# EAGLE design mtD-Relay1C(ACTP112)fotCo2 (EAGLE 7.4.0)
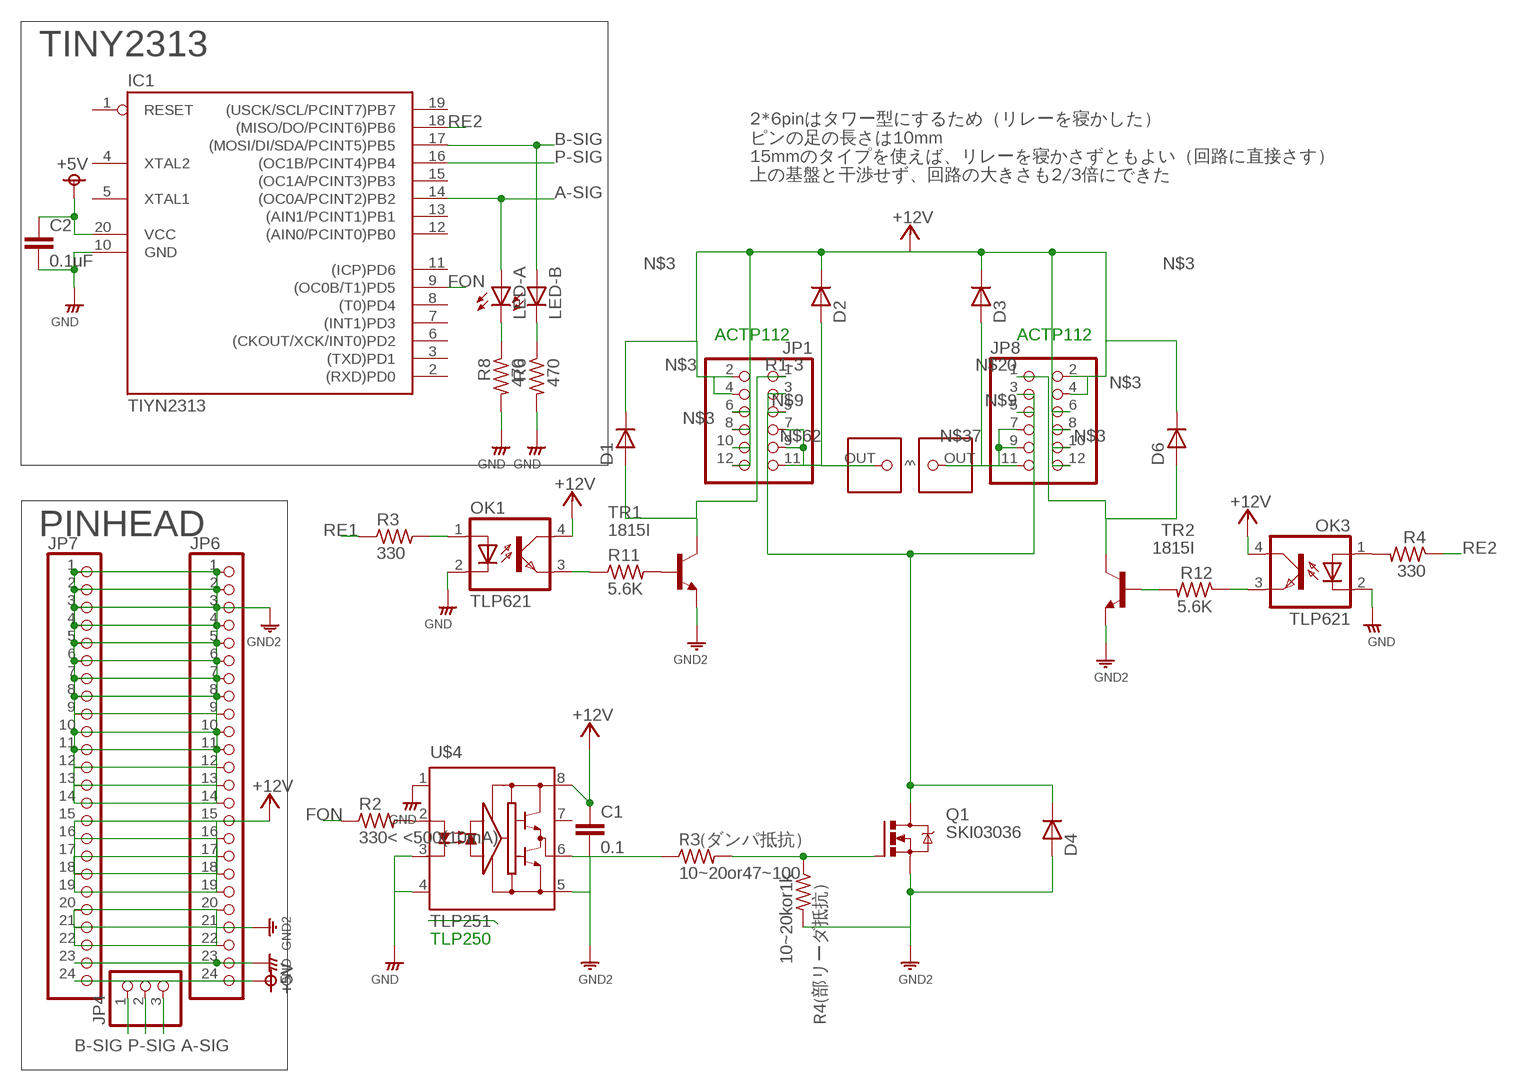
[diagram p0: schematic, sheet 1]

## Parts
C1  0.1  MLCC-2  [MLCC_25]
C2  0.1uF  MLCC-2  [MLCC_25]
D1  DIODE_JISSO2  [DIODE_JISSO2]
D2  DIODE_JISSO2  [DIODE_JISSO2]
D3  DIODE_JISSO2  [DIODE_JISSO2]
D4  DIODE_JISSO2  [DIODE_JISSO2]
D6  DIODE_JISSO2  [DIODE_JISSO2]
IC1  TIYN2313  [DIL20]
JP1  PINHD-2X6  [2X06]
JP4  PINHD-1X3  [1X03]
JP6  PINHD-1X24  [1X24]
JP7  PINHD-1X24  [1X24]
JP8  PINHD-2X6  [2X06]
LED-A  LED3MM  [LED3MM]
LED-B  LED3MM  [LED3MM]
OK1  TLP621  [DIP4]
OK3  TLP621  [DIP4]
Q1  SKI03036  [SKI03036]
R2  330< <500(10mA)  RESISTORS3216  [3216]
R3  330  RESISTORS-3  [R_0.3]
R3(ダンパ抵抗）  10~20or47~100  RESISTORS1608  [1608]
R4  330  RESISTORS-3  [R_0.3]
R4(部リーダ抵抗）  10~20kor1k  RESISTORS1608  [1608]
R6  470  RESISTORS3216  [3216]
R8  470  RESISTORS3216  [3216]
R11  5.6K  RESISTORS-3  [R_0.3]
R12  5.6K  RESISTORS-3  [R_0.3]
TR1  1815I  [TO92A]
TR2  1815I  [TO92A]
U$3  OUTPIN-PV-3  [OUTPIN-PV-3]
U$4  TLP251  [DIP8]
U$15  OUTPIN-PV-3  [OUTPIN-PV-3]

## Nets
+5V: C2.1 IC1.20(VCC) JP6.24 JP7.24
+12V: OK1.4(COL) OK3.4(COL)
A-SIG: IC1.14((OC0A/PCINT2)PB2) JP4.3 LED-A.A
B-SIG: IC1.17((MOSI/DI/SDA/PCINT5)PB5) JP4.1 LED-B.A
FON: IC1.9((OC0B/T1)PD5) R2.P$5
GND: C2.2 IC1.10(GND) JP6.23 JP7.23 OK1.2(C) OK3.2(C) R6.P$6 R8.P$6 U$4.1 U$4.3 U$4.4
N$2: R11.2 TR1.B
N$3: C1.1 D1.P$2(C) D2.P$2(C) D3.P$2(C) D6.P$2(C) JP1.2 JP1.4 JP1.6 JP1.8 JP1.10 JP1.12 JP6.15 JP6.16 JP6.17 JP6.18 JP6.19 JP7.15 JP7.16 JP7.17 JP7.18 JP7.19 JP8.2 JP8.4 JP8.6 JP8.8 JP8.10 JP8.12 U$4.8 ; supply symbol labelled +12V
N$5: R12.2 TR2.B
N$6: R3(ダンパ抵抗）.P$1 U$4.6
N$8: Q1.G R3(ダンパ抵抗）.P$2 R4(部リーダ抵抗）.P$1
N$9: D4.P$2(C) JP1.3 JP1.5 JP8.3 JP8.5 Q1.D
N$10: R2.P$6 U$4.2
N$11: LED-B.K(C) R6.P$5
N$12: LED-A.K(C) R8.P$5
N$17: OK1.1(A) R3.2
N$20: D6.P$1(A) JP8.1 TR2.C
N$21: OK1.3(EMIT) R11.1
N$37: D3.P$1(A) JP8.7 JP8.9 JP8.11 U$15.OUT(^)
N$38: OK3.1(A) R4.2
N$43: C1.2 D4.P$1(A) JP6.1 JP6.2 JP6.3 JP6.4 JP6.5 JP6.6 JP6.7 JP6.8 JP6.9 JP6.10 JP6.11 JP6.12 JP6.13 JP6.14 JP6.20 JP6.21 JP6.22 JP7.1 JP7.2 JP7.3 JP7.4 JP7.5 JP7.6 JP7.7 JP7.8 JP7.9 JP7.10 JP7.11 JP7.12 JP7.13 JP7.14 JP7.20 JP7.21 JP7.22 Q1.S R4(部リーダ抵抗）.P$2 TR1.E TR2.E U$4.5 ; supply symbol labelled GND2
N$44: OK3.3(EMIT) R12.1
N$62: D2.P$1(A) JP1.7 JP1.9 JP1.11 U$3.OUT(^)
P-SIG: IC1.16((OC1B/PCINT4)PB4) JP4.2
R1-3: D1.P$1(A) JP1.1 TR1.C
RE1: R3.1
RE2: IC1.18((MISO/DO/PCINT6)PB6) R4.1
Unconnected: IC1.1(RESET) IC1.2((RXD)PD0) IC1.3((TXD)PD1) IC1.4(XTAL2) IC1.5(XTAL1) IC1.6((CKOUT/XCK/INT0)PD2) IC1.7((INT1)PD3) IC1.8((T0)PD4) IC1.11((ICP)PD6) IC1.12((AIN0/PCINT0)PB0) IC1.13((AIN1/PCINT1)PB1) IC1.15((OC1A/PCINT3)PB3) IC1.19((USCK/SCL/PCINT7)PB7) U$4.7

## Notes on the sheet
- TINY2313
- 2*6pinはタワー型にするため（リレーを寝かした）
  ピンの足の長さは10mm
  15mmのタイプを使えば、リレーを寝かさずともよい（回路に直接さす）
  上の基盤と干渉せず、回路の大きさも2/3倍にできた
- ACTP112 | ACTP112
- PINHEAD
- TLP250

## Library data of the parts
C1 C2 = rcl__s:MLCC: CAPACITOR, European symbol
D1-D4 D6 = diode_s:DIODE
IC1 = avr_s:TIYN2313: MICROCONTROLLER 2 Kbytes FLASH 128 bytes SRAM 128 bytes EEPROM UART
JP1 JP8 = pinhead_s:PINHD-2X6: PIN HEADER
JP4 = pinhead_s:PINHD-1X3: PIN HEADER
JP6 JP7 = pinhead_s:PINHD-1X24: PIN HEADER
LED-A LED-B = LED_s:LED: LED OSRAM: - CHIPLED LG R971, LG N971, LY N971, LG Q971, LY Q971, LO R971, LY R971 LH N974, LH R974 LS Q976, LO Q976, LY Q976 LO Q996 - Hyper CHIPLED LW Q18S LB Q993, LB Q99A, LB R99A - SideLED LS A670, LO A670, LY A670, LG A670, LP A670 LB A673, LV A673, LT A673, LW A673 LH A674 LY A675 LS A676, LA A676, LO A676, LY A676, LW A676 LS A679, LY A679, LG A679 - Hyper Micro SIDELED® LS Y876, LA Y876, LO Y876, LY Y876 LT Y87S - SmartLED LW L88C, LW L88S LB L89C, LB L89S, LG L890 LS L89K, LO L89K, LY L89K LS L896, LA L896, LO L896, LY L896 - TOPLED LS T670, LO T670, LY T670, LG T670, LP T670 LSG T670, LSP T670, LSY T670, LOP T670, LYG T670 LG T671, LOG T671, LSG T671 LB T673, LV T673, LT T673, LW T673 LH T674 LS T676, LA T676, LO T676, LY T676, LB T676, LH T676, LSB T676, LW T676 LB T67C, LV T67C, LT T67C, LS T67K, LO T67K, LY T67K, LW E67C LS E67B, LA E67B, LO E67B, LY E67B, LB E67C, LV E67C, LT E67C LW T67C LS T679, LY T679, LG T679 LS T770, LO T770, LY T770, LG T770, LP T770 LB T773, LV T773, LT T773, LW T773 LH T774 LS E675, LA E675, LY E675, LS T675 LS T776, LA T776, LO T776, LY T776, LB T776 LHGB T686 LT T68C, LB T68C - Hyper Mini TOPLED® LB M676 - Mini TOPLED Santana® LG M470 LS M47K, LO M47K, LY M47K Source: http://www.osram.convergy.de - LUMILED® LXK2-PW12-R00, LXK2-PW12-S00, LXK2-PW14-U00, LXK2-PW14-V00 LXK2-PM12-R00, LXK2-PM12-S00, LXK2-PM14-U00 LXK2-PE12-Q00, LXK2-PE12-R00, LXK2-PE12-S00, LXK2-PE14-T00, LXK2-PE14-U00 LXK2-PB12-K00, LXK2-PB12-L00, LXK2-PB12-M00, LXK2-PB14-N00, LXK2-PB14-P00, LXK2-PB14-Q00 LXK2-PR12-L00, LXK2-PR12-M00, LXK2-PR14-Q00, LXK2-PR14-R00 LXK2-PD12-Q00, LXK2-PD12-R00, LXK2-PD12-S00 LXK2-PH12-R00, LXK2-PH12-S00 LXK2-PL12-P00, LXK2-PL12-Q00, LXK2-PL12-R00 Source: www.luxeon.com
OK1 OK3 = photocoupler_s:TLP621: SHARP OPTO COUPLER
Q1 = FET_s:SKI03036
R2 R3 R3(ダンパ抵抗） R4 R4(部リーダ抵抗） R6 R8 R11 R12 = rcl__s:RESISTORS
TR1 TR2 = transistor_s:1815: NPN Transistor
U$3 U$15 = Output-PV-3:OUTPIN-PV-3
U$4 = photocoupler_s:TLP251

## Module A
Ports: 

### Library data of the parts

## Board
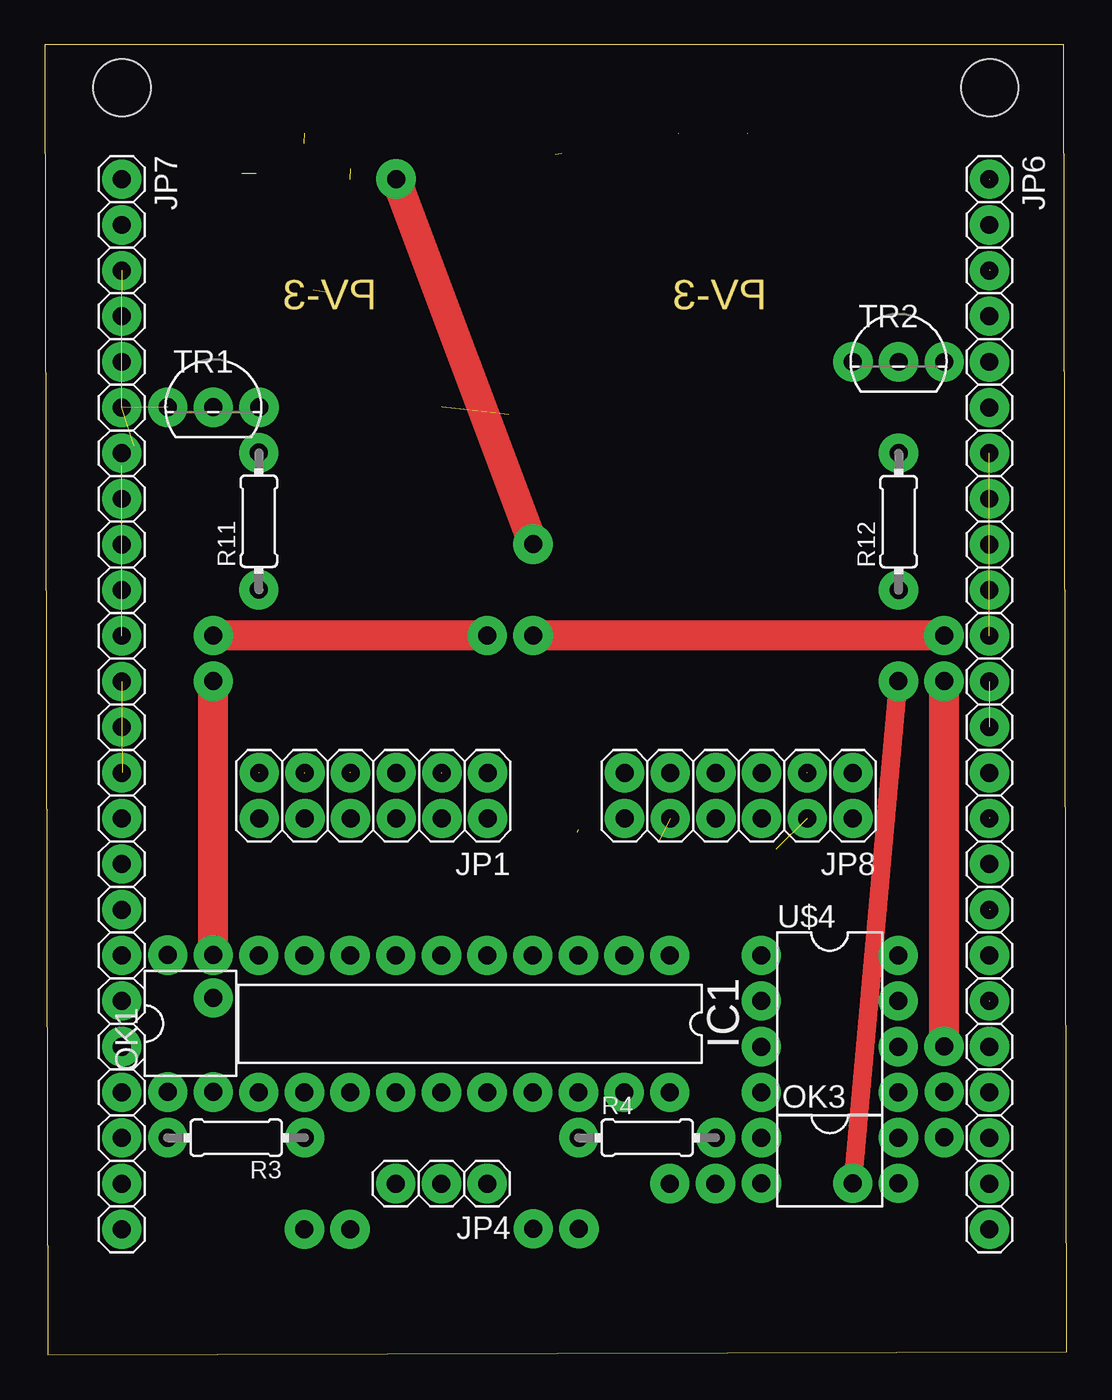
[diagram p1: board, top side]
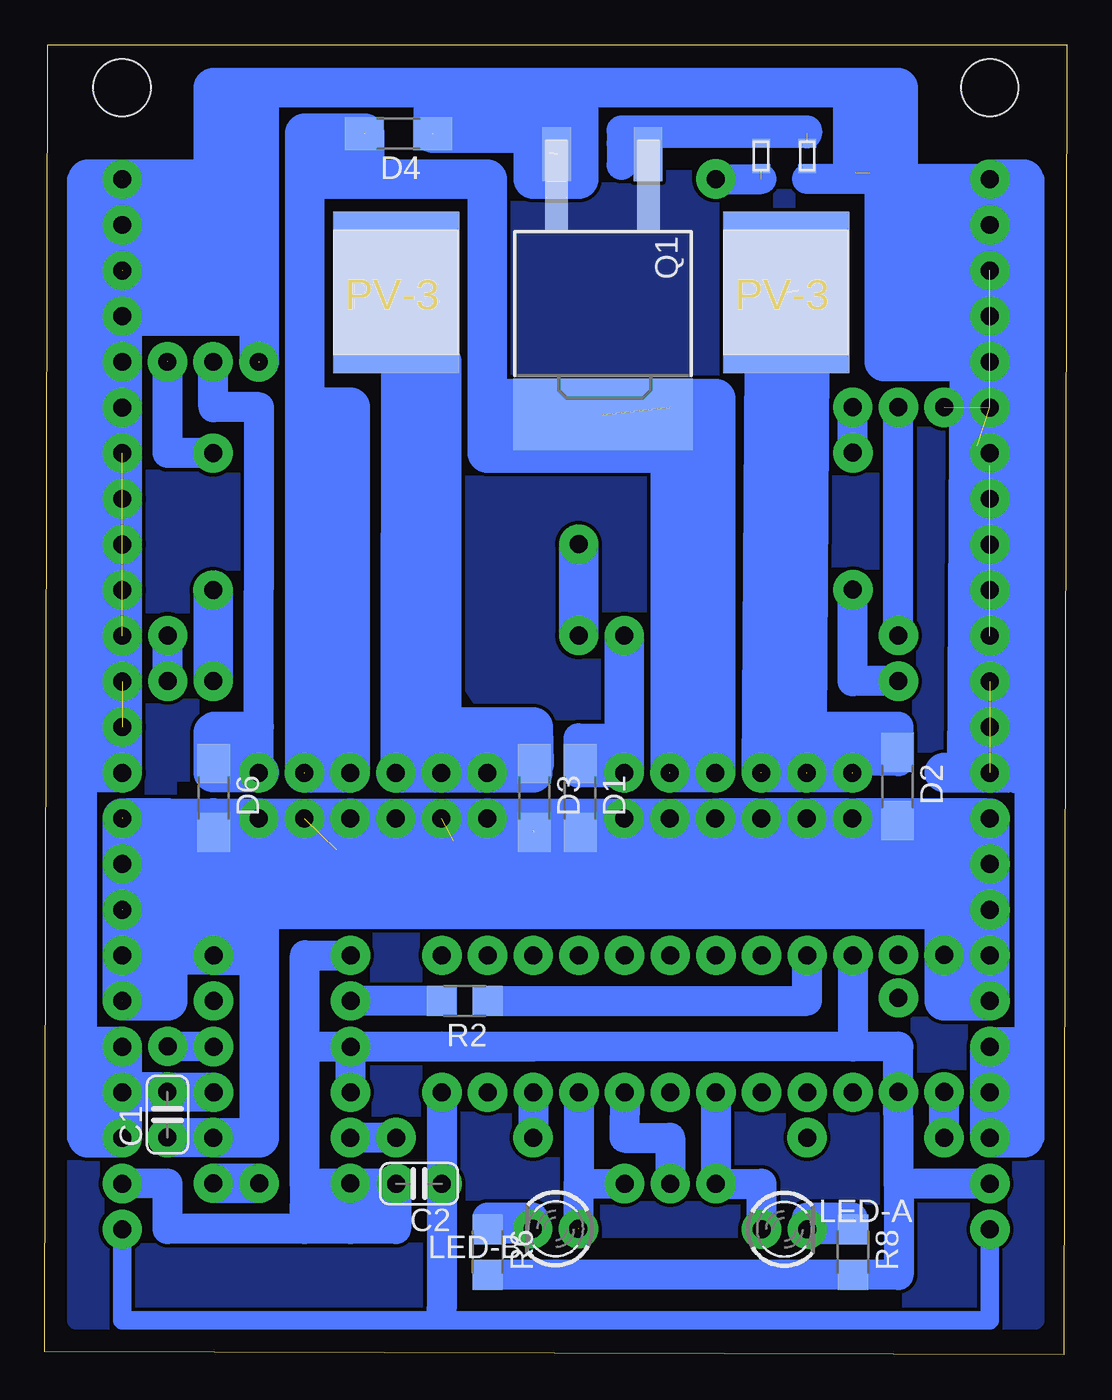
[diagram p2: board, bottom side, seen from below]

Size 56.83 x 72.87 mm. Coordinates in mm from the lower left corner, seen from the top.
Outline: 0,72.87 0.16,0 56.83,0.16 56.67,72.87 0,72.87
Copper layers (1*16): Top 0.035mm / dielectric 1.5mm / Bottom 0.035mm
Design rules "default": minimum track width 10mil, minimum drill 24mil, track to track 8mil, track to pad 8mil, pad to pad 8mil, via to via 8mil, smd to smd 8mil, copper to edge 40mil, drill to drill 8mil, minimum pad ring 10mil, minimum via ring 8mil, stop-mask expansion 4mil, vias tented up to drill 0mil, thermal gap 10mil
Holes 3.2 mm at 4.29,70.48 52.55,70.48

### Footprints (pad centres in the part's own frame; a part is rotated, then mirrored left to right if it is on the bottom)
MLCC_25 = drill 1 pad 2.184: 1 -1.27,0; 2 1.27,0
DIODE_JISSO2 = smd 2.184 x 1.829: P$1 -1.905,0; P$2 1.905,0
DIL20 = drill 1 pad 2.184: 1 -3.81,12.7; 2 -3.81,10.16; 3 -3.81,7.62; 4 -3.81,5.08; 5 -3.81,2.54; 6 -3.81,0; 7 -3.81,-2.54; 8 -3.81,-5.08; 9 -3.81,-7.62; 10 -3.81,-10.16; 11 3.81,-10.16; 12 3.81,-7.62; 13 3.81,-5.08; 14 3.81,-2.54; 15 3.81,0; 16 3.81,2.54; 17 3.81,5.08; 18 3.81,7.62; 19 3.81,10.16; 20 3.81,12.7
2X06 = drill 1 pad 2.184: 1 -6.35,-1.27; 2 -6.35,1.27; 3 -3.81,-1.27; 4 -3.81,1.27; 5 -1.27,-1.27; 6 -1.27,1.27; 7 1.27,-1.27; 8 1.27,1.27; 9 3.81,-1.27; 10 3.81,1.27; 11 6.35,-1.27; 12 6.35,1.27
1X03 = drill 1 pad 2.184: 1 -2.54,0; 2 0,0; 3 2.54,0
1X24 = drill 1 pad 2.184: 1 -29.21,0; 2 -26.67,0; 3 -24.13,0; 4 -21.59,0; 5 -19.05,0; 6 -16.51,0; 7 -13.97,0; 8 -11.43,0; 9 -8.89,0; 10 -6.35,0; 11 -3.81,0; 12 -1.27,0; 13 1.27,0; 14 3.81,0; 15 6.35,0; 16 8.89,0; 17 11.43,0; 18 13.97,0; 19 16.51,0; 20 19.05,0; 21 21.59,0; 22 24.13,0; 23 26.67,0; 24 29.21,0
LED3MM = drill 1 pad 2.184: A -1.27,0; K 1.27,0
DIP4 = drill 1 pad 2.184: 1 -1.27,-3.81; 2 1.27,-3.81; 3 1.27,3.81; 4 -1.27,3.81
SKI03036 = smd 10 x 4: D 0,6.295 | smd 1.6 x 3: G -2.511,-8.2; S 2.568,-8.2
3216 = smd 1.676 x 1.676: P$5 0,0; P$6 2.54,0
R_0.3 = drill 1 pad 2.184: 1 -3.81,0; 2 3.81,0; 3 -3.81,0
1608 = smd 0.5 x 1: P$1 -0.7,0; P$2 0.7,0
TO92A = drill 1 pad 2.184: B 2.54,0; C 0,0; E -2.54,0
OUTPIN-PV-3 = smd 7 x 9: OUT -0.31,-0.325
DIP8 = drill 1 pad 2.184: 1 -3.81,-3.81; 2 -1.27,-3.81; 3 1.27,-3.81; 4 3.81,-3.81; 5 3.81,3.81; 6 1.27,3.81; 7 -1.27,3.81; 8 -3.81,3.81

### Placement (x,y rotation side)
C1  50.02,13.35 90 bottom
C2  36.02,9.51 180 bottom
D1  27.07,30.98 270 bottom
D2  9.42,31.61 270 bottom
D3  29.61,30.98 270 bottom
D4  37.17,67.93 180 bottom
D6  47.45,30.98 270 bottom
IC1  22.05,18.4 270 top
JP1  18.27,31.1 180 top
JP4  22.05,9.51 180 top
JP6  52.53,36.18 270 top
JP7  4.27,36.18 270 top
JP8  38.59,31.1 180 top
LED-A  15.7,6.97 0 bottom
LED-B  28.43,7 180 bottom
OK1  8.1,18.42 0 top
OK3  43.66,10.79 270 top
Q1  25.8,58.6 180 bottom
R2  32.21,19.67 180 bottom
R3  10.64,12.06 180 top
R3(ダンパ抵抗）  17,66.69 90 bottom
R4  33.5,12.06 0 top
R4(部リーダ抵抗）  14.43,66.69 270 bottom
R6  32.21,6.97 270 bottom
R8  11.89,6.97 270 bottom
R11  11.89,46.37 90 top
R12  47.48,46.34 90 top
TR1  9.37,52.7 0 top
TR2  47.48,55.23 0 top
U$3  15.29,59.42 0 bottom
U$4  43.64,18.4 270 top
U$15  36.98,59.42 0 bottom

### Tracks (layer width: path | path; a pad name or v marks a point on that pad's centre or on a via)
+5V
  Bottom 1.016: 34.77,1.91 4.29,1.91 4.29,4.43 JP7.24 | 34.77,1.91 52.55,1.91 JP6.24 | 34.77,2.54 34.77,1.91
  Bottom 1.676: IC1.20 C2.1 | C2.1 | C2.1 34.77,2.54
+12V
  Bottom 2.184: OK1.4 6.83,24.77 44.93,24.77 44.93,12.06 OK3.4
A-SIG
  Bottom 1.676: LED-A.A 16.97,9.51 JP4.3 IC1.14
B-SIG  (1 unrouted)
  Bottom 1.676: JP4.1 27.15,9.52 27.15,9.53 | LED-B.A 27.15,9.53 | IC1.17 27.15,9.53
FON
  Bottom 1.676: R2.P$5 14.45,19.69 IC1.9
GND
  Bottom 1.016: R8.P$6 9.35,4.43 | 34.77,17.14 34.77,17.12 U$4.3
  Bottom 1.676: IC1.10 11.89,17.13 | 9.35,9.51 9.35,4.43 R6.P$6 | 42.37,17.13 42.37,22.21 U$4.1 | U$4.4 U$4.3 42.37,17.13 | 11.89,17.13 34.77,17.14 | JP7.23 9.35,9.51 | 9.35,9.51 9.37,17.14 | 9.37,17.14 11.89,17.13 | 39.85,6.99 37.31,6.99 C2.2 42.39,9.53 42.37,9.53 | 39.85,6.99 42.39,6.99 | 42.39,6.99 50.01,6.99 50.01,9.53 JP6.23 | 42.37,9.53 42.39,17.14 42.37,17.13 | 42.37,9.53 42.39,6.99 | 42.39,6.99 42.39,8.25 38.58,8.25 | OK3.2 39.85,6.99 | OK1.2 9.37,17.14
N$2
  Bottom 1.676: R11.2 TR1.B
N$3  (6 unrouted)
  Bottom 1.676: 44.93,22.23 U$4.8 44.93,22.21 | JP7.16 4.29,29.21 6.83,29.21
  Bottom 2.184: 52.53,26.67 JP6.18 48.74,22.23 | 52.53,26.67 JP6.16 JP6.15 JP8.2 | JP7.19 JP7.18 JP7.17 | JP7.17 JP7.16 | JP6.18 JP6.19 51.28,19.69 | 51.28,19.69 50.01,19.69 50.01,29.85 51.28,29.85 | JP6.15 51.28,29.85 | 51.28,29.85 51.28,19.69 | JP7.16 JP7.15 | JP7.16 JP7.15 JP1.12 | JP1.12 JP1.6 | JP1.12 11.91,27.3 D2.P$2 JP7.16 | JP1.12 JP1.6 | 14.45,27.3 JP1.10 JP1.8 | JP1.8 JP1.6 | JP1.6 19.53,26.35 | 19.53,26.35 19.53,24.77 27.15,24.77 | 27.15,24.77 29.69,24.77 | 29.69,27.3 32.23,27.3 | 32.23,27.3 JP8.12 JP8.6 | JP8.6 | JP7.17 29.69,24.77 | JP7.17 JP7.16 19.53,27.3 19.53,28.73 12.7,28.73 | JP1.12 11.75,26.19 19.53,26.35 | 29.69,27.3 29.69,29.21 31.59,29.21 | 29.69,24.77 39.85,24.77 | 39.85,24.77 39.85,26.51 | 39.85,26.51 39.85,27.3 | 39.85,27.3 JP8.6 | 29.69,26.04 29.69,27.3 | 32.23,27.3 34.77,27.3 | 34.77,27.3 39.85,27.3 | 29.69,24.77 29.69,26.04 | 29.69,26.04 34.77,26.04 | 39.85,24.77 JP6.17 | 34.77,27.3 34.77,26.04 | 34.77,26.04 38.58,26.04 | U$4.8 44.93,22.21 44.93,12.06 C1.1 | 44.93,22.23 48.74,22.23 | 48.74,22.23 48.74,23.5 46.2,23.5 46.2,22.86 | JP1.8 JP1.4 | JP1.4 JP1.2 | JP1.4 47.47,29.85 JP8.2 | D1.P$2 27.15,24.77 | 27.15,24.77 27.15,26.83 21.11,26.83 21.11,28.26 28.1,28.1 28.58,26.67 34.13,28.58 38.74,28.42 | JP8.8 JP8.6 | JP8.6 JP8.2 | JP8.6 39.85,26.51 | 39.85,26.51 47.48,26.61 | 47.48,26.61 52.53,26.67 | JP8.6 40.64,28.1 48.9,28.1 | D6.P$2 47.47,27.3 47.48,26.61
N$5  (1 unrouted)
  Bottom 1.676: R12.2 50.01,50.16 50.01,55.26
N$6  (via drill 1 pad 2.18)  (1 unrouted)
  Top 1.676: v50.01,40.01 v27.15,40.01 | v50.01,17.14 v50.01,37.47 | v27.15,45.09 v19.53,65.41
  Bottom 1.676: U$4.6 v50.01,17.14 | v50.01,37.47 v50.01,40.01 | 19.54,65.41 v19.53,65.41 16.99,65.41
  Bottom 2.184: v27.15,40.01 v27.15,45.09
N$7
  Bottom 1.676: 39.85,17.14 29.69,17.14
N$8  (1 unrouted)
  Bottom 0.406: R3(ダンパ抵抗）.P$2 24.77,67.39 24.77,65.88 24.72,65.88 Q1.G
  Bottom 1.676: 24.77,66.2 24.77,67.39 24.77,68.1 14.45,68.1 14.45,67.95 24.45,67.95
N$9  (4 unrouted)
  Bottom 2.184: JP8.3 JP8.5 | JP1.5 JP1.3 | 39.85,67.95 42.39,67.95 42.39,65.41 | 19.53,52.7 JP1.5 20.96,32.38 | 41.28,32.38 JP8.3 42.39,52.7 | 42.39,52.7 42.39,65.41 | 42.39,65.41 39.85,65.41 | 39.85,65.41 32.23,65.41 32.23,52.7 | 32.23,52.7 32.23,50.16 30.96,50.16 | 30.96,50.16 22.07,50.16 | 22.07,52.7 JP1.3 | 19.53,52.7 20.96,52.7 | 22.07,52.7 32.23,52.7 | 22.07,52.7 20.96,52.7 | 20.96,52.7 20.96,32.38 | 20.96,32.38 JP1.3 | 42.39,52.7 39.85,52.7 JP8.5 41.28,32.38 | 41.28,32.38 41.28,51.91 | 39.85,67.95 39.85,65.41 | 42.39,65.41 39.85,67.95 | 39.85,67.95 39.05,67.95 39.05,66.67 | 30.96,50.16 30.96,51.75 | 19.53,52.7 19.53,53.18 31.91,53.18
N$10
  Bottom 1.676: R2.P$6 U$4.2
N$11
  Bottom 1.676: LED-B.K R6.P$5
N$12
  Bottom 1.676: LED-A.K R8.P$5 | R8.P$5 | R8.P$5 11.91,7.62 14.45,7.62 LED-A.K
N$16
  Bottom 1.016: 44.93,28.58 48.1,28.58 | 44.93,29.85 48.1,29.85 48.1,27.3 | 44.93,29.21 46.83,29.21
  Bottom 1.27: 47.47,27.3 47.94,27.3 47.94,28.42
  Bottom 2.184: 42.39,27.3 44.93,27.3 | 44.93,27.3 47.47,27.3 | 44.93,29.85 44.93,29.21 44.93,28.58 44.93,27.3
N$17
  Bottom 1.676: R3.2 OK1.1
N$20
  Bottom 1.676: 47.47,32.38 JP8.1 44.93,52.7 47.47,52.7 TR2.C | 47.47,32.38 44.93,34.93 47.47,34.93 47.47,34.61 | 47.47,32.38 D6.P$1
  Bottom 2.184: JP8.1 47.47,32.38 47.47,34.61
N$21  (via drill 1 pad 2.18)
  Top 1.676: OK1.3 v9.37,37.47
  Bottom 1.676: 11.91,37.47 11.89,37.47 | 11.89,37.47 R11.1 | v9.37,37.47 11.89,37.47
N$23
  pour Bottom (isolate 1.016, rank 5): 1.75,40.01 1.75,42.55 4.29,52.7
N$28
  Bottom 1.676: 29.69,6.99 29.69,7.62 32.23,7.62
N$33
  pour Bottom: 22.07,50.16 22.07,32.38 29.69,32.38 34.77,40.01 34.77,50.16
N$34
  pour Bottom (rank 5): 4.29,57.79 13.02,57.79 14.45,65.41 52.55,65.41 52.55,32.38 34.77,32.38 34.77,42.55 29.69,42.55 29.69,32.38 4.29,32.38
N$37
  Bottom 1.676: JP8.7 U$15.OUT
  Bottom 1.93: 33.48,32.37 JP8.9 JP8.11
  Bottom 2.184: JP8.9 JP8.7 JP8.11 29.7,32.37 29.69,34.93 | D3.P$1 29.69,34.93 | 34.77,34.93 JP8.9 36.51,32.38 36.51,48.9 36.35,48.9 36.35,55.56 | 34.77,34.93 34.77,55.25 | 29.69,34.93 33.5,34.93 | 34.77,34.93 33.5,34.93 | 33.5,34.93 33.5,33.66 30.96,33.66
N$38
  Bottom 1.676: R4.2 OK3.1
N$42
  Bottom 1.676: 50.01,60.33 52.55,60.33
N$43  (23 unrouted)
  Bottom 0.406: 14.45,65.41 14.43,65.41 R4(部リーダ抵抗）.P$2
  Bottom 0.813: JP7.7 4.27,49.45 4.97,49.45 4.97,50.53
  Bottom 1.016: JP7.22 1.75,12.06 1.75,32.38 | 1.75,32.38 1.75,65.41 | 1.75,65.41 JP7.1 | JP7.20 2.7,17.14 | 2.7,65.41 3.02,65.41 | 1.75,65.41 2.38,65.41 2.7,65.41 | 2.7,65.41 2.7,31.75 2.86,31.75 | 1.75,32.38 2.38,32.38 2.38,17.3 | 54.45,12.06 55.09,12.06 55.09,32.38 | 55.09,32.38 55.09,34.93 | 55.09,34.93 55.09,65.41 54.45,65.41 | 55.09,32.38 JP6.14 JP6.13 | 55.09,34.93 54.45,34.93 54.45,12.22
  Bottom 1.27: 6.83,32.38 6.83,31.91 3.33,31.91
  Bottom 1.676: 11.91,65.72 11.75,65.72 11.75,65.41 | 11.75,65.41 14.45,65.41 | JP7.1 11.75,65.41
  Bottom 2.184: JP6.3 JP6.14 53.82,32.38 | 52.55,61.59 JP6.1 | 54.29,32.38 53.82,32.38 | 53.82,32.38 53.82,65.09 | 5.4,60.33 6.83,60.33 6.83,61.59 | 5.4,60.33 JP7.3 JP7.2 | 51.44,62.87 JP6.2 52.55,64.13 46.51,64.13 | 50.01,62.87 44.93,62.87 | 54.45,65.41 JP6.1 | JP6.1 47.47,65.41 | 46.36,65.41 44.93,65.41 | 44.93,65.41 44.93,70.48 | 44.93,70.48 35.24,70.48 | 35.24,70.48 29.69,70.48 | 29.69,70.48 28.73,70.48 | 27.15,70.48 11.91,70.48 | JP6.7 JP6.6 JP6.5 JP6.4 | JP6.4 JP6.2 JP6.1 | JP7.2 JP7.1 | 44.93,57.79 JP6.4 | 11.91,70.48 11.91,65.72 | 11.91,70.48 9.37,70.48 9.37,65.72 | 10.95,65.72 10.95,69.22 10.64,69.22 | 29.69,69.22 29.69,67.95 | 29.69,67.95 29.69,65.41 27.15,65.41 27.15,70.48 | 27.15,70.48 28.73,70.48 | 28.73,70.48 28.73,66.83 | 29.69,67.95 35.24,67.95 35.24,70.48 | 29.69,70.48 29.69,69.22 | 29.69,69.22 34.13,69.22 | 44.93,70.48 47.47,70.48 47.47,65.41 | 47.47,65.41 46.36,65.41 | 46.36,65.41 46.36,68.9 46.67,68.9 | 44.93,62.87 44.93,65.41 | JP7.2 JP7.1 2.38,65.41 | JP7.2 6.83,62.87 6.83,61.59 | 6.83,61.59 4.45,61.59 | JP7.14 JP7.3 | 6.83,32.38 5.56,32.38 | JP7.14 5.56,32.38 | 5.56,32.38 5.4,60.33 | U$4.5 JP6.21 | JP6.21 JP6.22 | JP6.22 JP6.21 JP6.20 | 50.01,57.79 50.01,60.33 | 50.01,60.33 50.01,62.87 | 50.01,62.87 51.44,62.87 | 51.44,62.87 51.44,58.9 51.75,58.9 | JP6.3 50.01,60.33 | JP7.22 JP7.21 | JP7.21 JP7.20 2.38,17.13 2.38,12.06 JP7.22 JP7.21 | JP6.22 54.45,12.06 | C1.2 JP6.21 | TR2.E 44.93,60.33 | 44.93,60.33 44.93,62.87 | 44.93,60.33 50.01,60.33 | JP6.3 52.55,61.59 | 52.55,61.59 46.2,61.59 46.2,59.69 48.74,59.69 48.74,59.05
N$44  (via drill 1 pad 2.18)
  Top 1.016: v44.93,9.53 v47.47,37.47
  Bottom 1.676: v47.47,37.47 R12.1
  Bottom 2.184: OK3.3 v44.93,9.53 | R12.1 v47.47,37.47
N$45
  pour Bottom (rank 5): 1.75,1.91 55.09,1.91 55.09,4.45 1.75,4.45
N$46
  pour Bottom (rank 5): 1.75,1.91 1.75,12.06 4.29,9.53 4.29,1.91
N$47
  pour Bottom (rank 5): 55.09,27.3 4.29,27.3 4.29,6.99 55.09,6.99
N$48
  pour Bottom (rank 5): 55.09,1.91 55.09,9.53 34.77,9.53 34.77,1.91
N$49
  pour Bottom (rank 5): 1.75,1.91 9.37,1.91 9.37,12.06 1.75,12.06
N$50
  Bottom 2.184: 4.29,19.69 6.83,19.69 6.83,24.77 5.72,24.77 5.72,20.48
N$51
  pour Bottom (rank 5): 55.09,27.3 50.01,27.3 50.01,40.01 52.55,34.93 55.09,34.93
N$53  (via drill 1 pad 2.18)
  other vias: 9.37,19.84
N$54
  pour Bottom (rank 5): 1.75,32.38 14.45,32.38 13.02,60.33 1.75,60.33
N$55
  Bottom 1.016: 39.53,6.99 40.16,6.99
N$56
  Bottom 2.184: 52.55,17.14 54.29,17.14 54.29,13.97 53.5,13.97
N$57
  Bottom 2.184: 4.29,55.25 9.21,55.25 | 9.21,55.25 9.21,55.56 10.16,55.56 10.16,64.93 8.1,64.93 | 7.94,64.93 8.1,64.93 | 8.1,64.93 8.1,56.83 7.14,56.83 | 6.99,56.83 7.14,56.83 | 7.14,56.83 7.14,64.13 5.87,64.13 | 9.21,55.25 10.16,55.25
N$58
  Bottom 2.184: 4.29,24.77 4.29,26.04 11.27,26.04
N$59
  Bottom 1.676: 24.61,32.38 27.15,32.38 | 27.15,32.38 27.15,34.29 24.61,34.29 27.15,32.38
N$60
  Bottom 2.184: 32.23,29.85 32.23,28.58 38.58,28.58
N$62  (4 unrouted)
  Bottom 1.676: 9.37,33.02 9.37,34.93 14.45,34.93 | 9.37,33.02 13.18,33.02 | U$3.OUT 15.56,57.79 | 14.92,59.21 14.92,59.05 | JP1.11 11.91,33.66 10,33.66 | JP1.9 14.45,34.29 12.54,34.29 | 9.37,33.02 D2.P$1
  Bottom 2.184: JP1.9 14.45,34.93 14.29,55.25 | 16.83,55.25 JP1.7 15.72,32.38 | JP1.9 15.72,32.38 | 15.72,32.38 15.56,56.52 15.56,57.79 | JP1.9 JP1.11
P-SIG
  Bottom 1.676: IC1.16 24.61,12.06 22.07,12.06 JP4.2
R1-3  (via drill 1 pad 2.18)
  Top 1.676: v24.61,40.01 v9.37,40.01
  Bottom 1.016: JP1.1 D1.P$1
  Bottom 1.676: v9.37,40.01 TR1.C
  Bottom 2.184: JP1.1 v24.61,40.01
RE2
  Bottom 1.676: IC1.18 R4.1